# EAGLE design ASPLY (EAGLE 6.1)
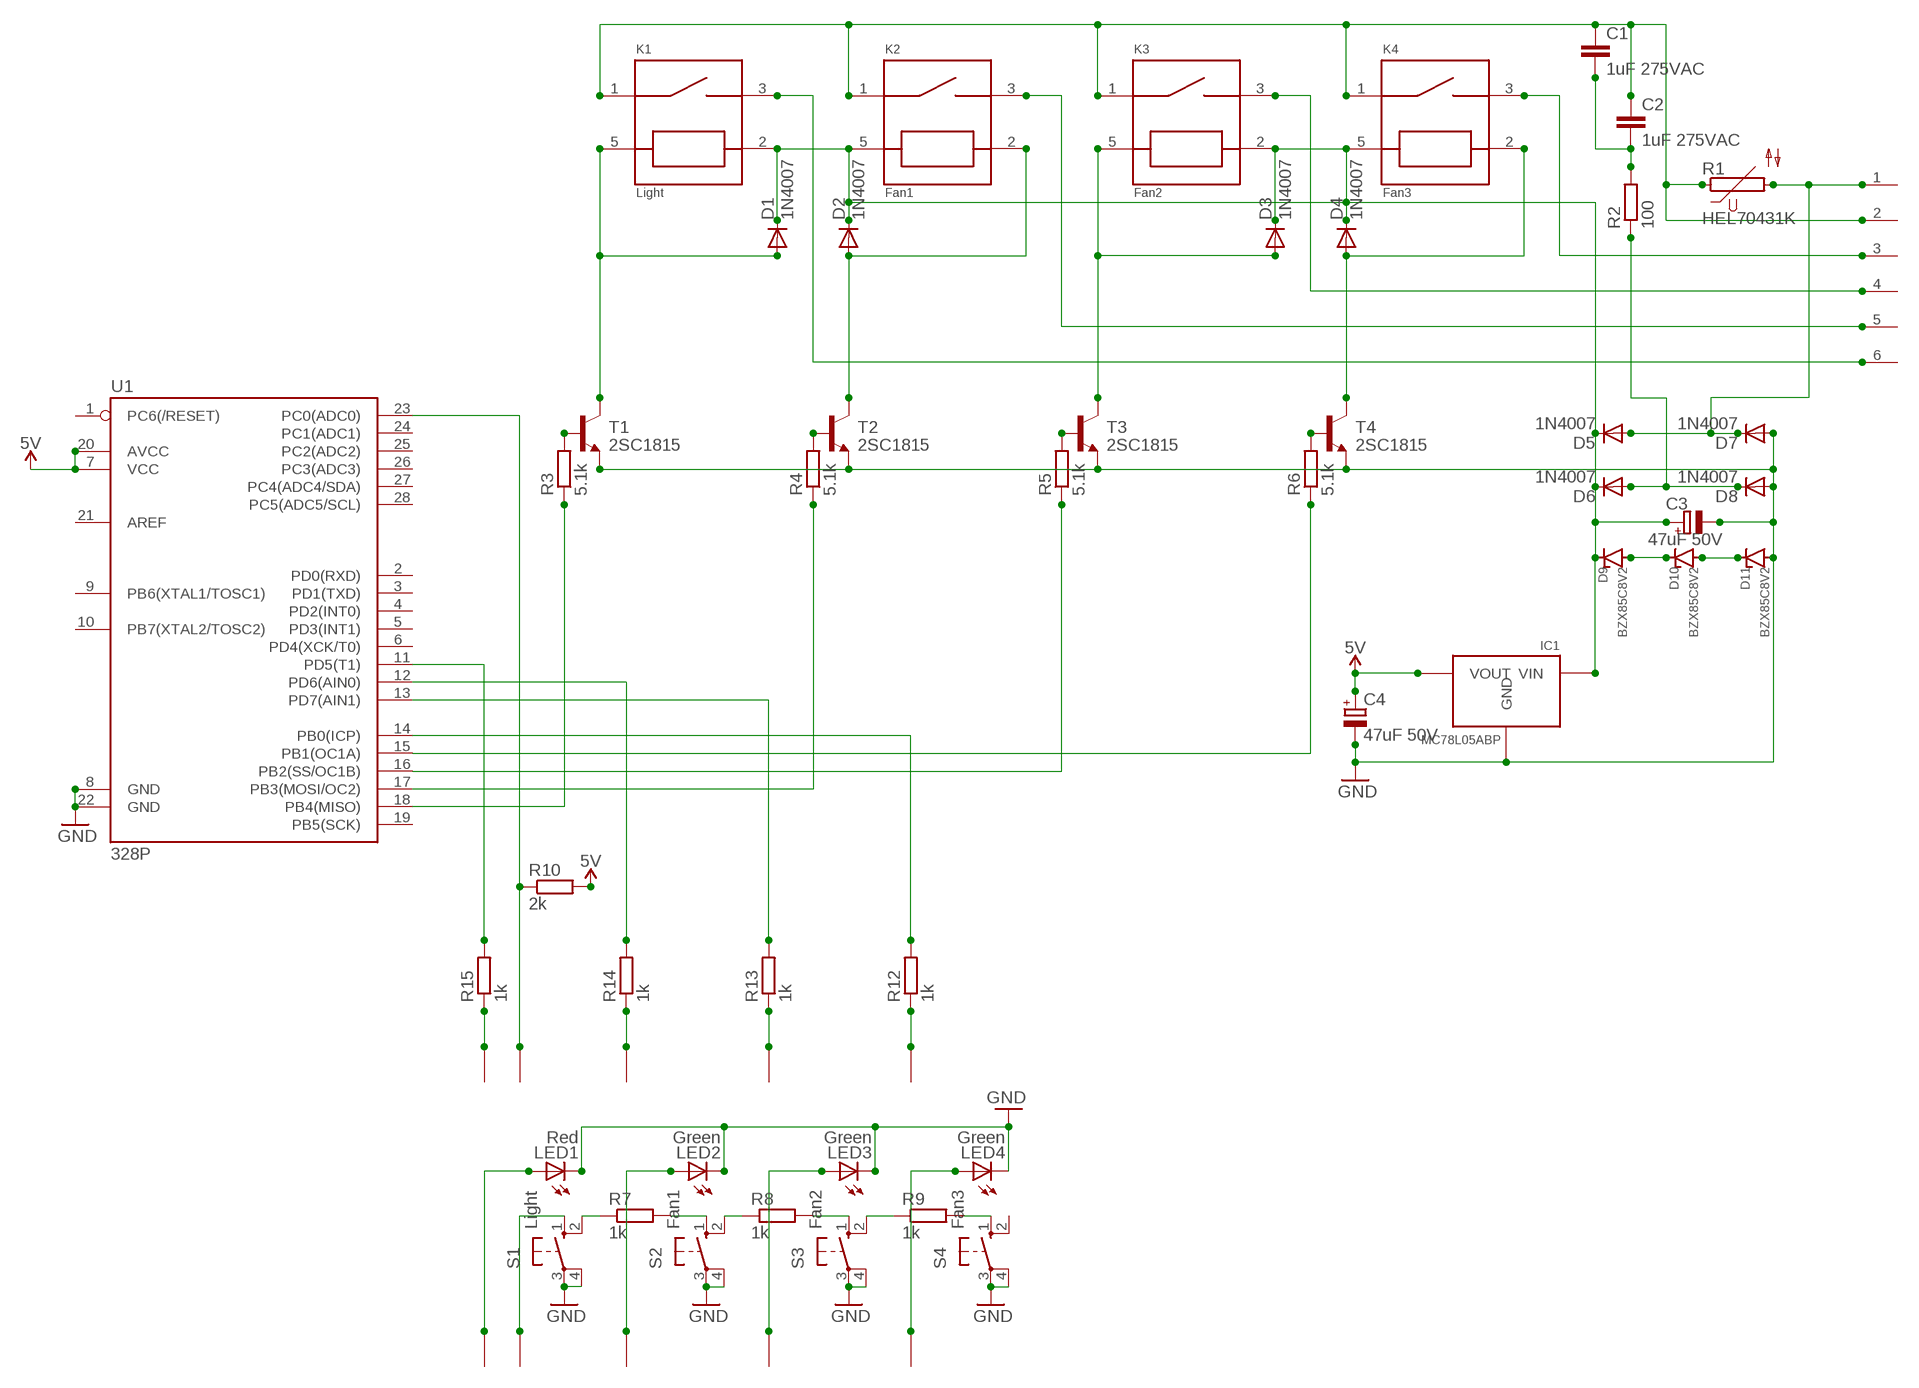
[diagram p0: schematic, sheet 1]

## Parts
C1  1uF 275VAC  C22/8  [C22.5B8]
C2  1uF 275VAC  C22/8  [C22.5B8]
C3  47uF 50V  CPOL-EUE5-6  [E5-6]
C4  47uF 50V  CPOL-EUE5-6  [E5-6]
D1  1N4007  1N4004  [DO41-10]
D2  1N4007  1N4004  [DO41-10]
D3  1N4007  1N4004  [DO41-10]
D4  1N4007  1N4004  [DO41-10]
D5  1N4007  1N4004  [DO41-10]
D6  1N4007  1N4004  [DO41-10]
D7  1N4007  1N4004  [DO41-10]
D8  1N4007  1N4004  [DO41-10]
D9  BZX85C8V2  STAB  [STAB]
D10  BZX85C8V2  STAB  [STAB]
D11  BZX85C8V2  STAB  [STAB]
IC1  MC78L05ABP  [TO-92]
K1  Light  HJR-3FF-S-Z  [RELAY]
K2  Fan1  HJR-3FF-S-Z  [RELAY]
K3  Fan2  HJR-3FF-S-Z  [RELAY]
K4  Fan3  HJR-3FF-S-Z  [RELAY]
LED1  Red  LED3MM  [LED3MM]
LED2  Green  LED3MM  [LED3MM]
LED3  Green  LED3MM  [LED3MM]
LED4  Green  LED3MM  [LED3MM]
P1  MOLEX  [MOLEX]
R1  HEL70431K  S05K11  [S05K11]
R2  100  R-EU_0617/22  [0617/22]
R3  5.1k  R-EU_0204/7  [0204/7]
R4  5.1k  R-EU_0204/7  [0204/7]
R5  5.1k  R-EU_0204/7  [0204/7]
R6  5.1k  R-EU_0204/7  [0204/7]
R7  1k  R-EU_0204/7  [0204/7]
R8  1k  R-EU_0204/7  [0204/7]
R9  1k  R-EU_0204/7  [0204/7]
R10  2k  R-EU_0204/7  [0204/7]
R12  1k  R-EU_0204/7  [0204/7]
R13  1k  R-EU_0204/7  [0204/7]
R14  1k  R-EU_0204/7  [0204/7]
R15  1k  R-EU_0204/7  [0204/7]
S1  Light  10-XX  [B3F-10XX]
S2  Fan1  10-XX  [B3F-10XX]
S3  Fan2  10-XX  [B3F-10XX]
S4  Fan3  10-XX  [B3F-10XX]
T1  2SC1815  [TO92-ECB]
T2  2SC1815  [TO92-ECB]
T3  2SC1815  [TO92-ECB]
T4  2SC1815  [TO92-ECB]
U1  328P  ATMEGA328P_PDIP  [DIP28]
U$1  PIN  [PIN]
U$3  PIN  [PIN]
U$5  PIN  [PIN]
U$7  PIN  [PIN]
U$8  PIN  [PIN]
U$13  PIN  [PIN]
U$14  PIN  [PIN]
U$16  PIN  [PIN]
U$18  PIN  [PIN]
U$20  PIN  [PIN]

## Nets
0: D5.A D7.C P1.1 R1.2
5V: C4.+ IC1.P$1(VOUT) R10.2 U1.7(VCC) U1.20(AVCC)
24V: C3.+ D1.C D2.C D3.C D4.C D5.C D6.C D9.P$1 IC1.P$3(VIN) K1.2 K2.5 K3.2 K4.5
220V: C1.1 C2.1 K1.1 K2.1 K3.1 K4.1 P1.2 R1.1
BUTTONS_INPUT: R10.1 U1.23(PC0(ADC0)) U$8.P$1
GND: C3.- C4.- D7.A D8.A D11.P$2 IC1.P$2(GND) LED1.K(C) LED2.K(C) LED3.K(C) LED4.K(C) S1.3(P) S1.4(P1) S2.3(P) S2.4(P1) S3.3(P) S3.4(P1) S4.3(P) S4.4(P1) T1.E T2.E T3.E T4.E U1.8(GND) U1.22(GND)
LED_FAN1: LED2.A U$18.P$1
LED_FAN1_OUTPUT: R14.2 U1.12(PD6(AIN0))
LED_FAN2: LED3.A U$16.P$1
LED_FAN2_OUTPUT: R13.2 U1.13(PD7(AIN1))
LED_FAN3: LED4.A U$14.P$1
LED_FAN3_OUTPUT: R12.2 U1.14(PB0(ICP))
LED_LIGHT: LED1.A U$20.P$1
LED_LIGHT_OUTPUT: R15.2 U1.11(PD5(T1))
N$1: S1.1(S) U$13.P$1
N$2: K4.3 P1.3
N$3: K3.3 P1.4
N$4: K2.3 P1.5
N$5: K1.3 P1.6
N$6: R7.1 S1.2(S1)
N$7: R6.1 U1.15(PB1(OC1A))
N$8: R5.1 U1.16(PB2(SS/OC1B))
N$9: D1.A K1.5 T1.C
N$10: D2.A K2.2 T2.C
N$11: D3.A K3.5 T3.C
N$12: D4.A K4.2 T4.C
N$13: D6.A D8.C R2.1
N$14: C1.2 C2.2 R2.2
N$15: R7.2 S2.1(S)
N$16: D9.P$2 D10.P$1
N$17: D10.P$2 D11.P$1
N$18: R3.2 T1.B
N$19: R4.2 T2.B
N$20: R5.2 T3.B
N$21: R6.2 T4.B
N$22: R8.1 S2.2(S1)
N$23: R8.2 S3.1(S)
N$24: R9.1 S3.2(S1)
N$25: R9.2 S4.1(S)
N$26: R15.1 U$1.P$1
N$27: R14.1 U$3.P$1
N$28: R13.1 U$5.P$1
N$29: R12.1 U$7.P$1
N$42: R4.1 U1.17(PB3(MOSI/OC2))
N$43: R3.1 U1.18(PB4(MISO))
Unconnected: S4.2(S1) U1.1(PC6(/RESET)) U1.2(PD0(RXD)) U1.3(PD1(TXD)) U1.4(PD2(INT0)) U1.5(PD3(INT1)) U1.6(PD4(XCK/T0)) U1.9(PB6(XTAL1/TOSC1)) U1.10(PB7(XTAL2/TOSC2)) U1.19(PB5(SCK)) U1.21(AREF) U1.24(PC1(ADC1)) U1.25(PC2(ADC2)) U1.26(PC3(ADC3)) U1.27(PC4(ADC4/SDA)) U1.28(PC5(ADC5/SCL))

## Library data of the parts
C1 C2 = capacitor-wima:C: CAPACITOR naming: grid - package width
C3 C4 = rcl:CPOL-EU: POLARIZED CAPACITOR, European symbol
D1-D8 = diode:1N4004: DIODE general purpose rectifier, 1 A
D9-D11 = ASPLY:STAB
IC1 = ASPLY:MC78L05ABP
K1-K4 = ASPLY:HJR-3FF-S-Z
LED1-LED4 = led:LED: LED OSRAM: - CHIPLED LG R971, LG N971, LY N971, LG Q971, LY Q971, LO R971, LY R971 LH N974, LH R974 LS Q976, LO Q976, LY Q976 LO Q996 - Hyper CHIPLED LW Q18S LB Q993, LB Q99A, LB R99A - SideLED LS A670, LO A670, LY A670, LG A670, LP A670 LB A673, LV A673, LT A673, LW A673 LH A674 LY A675 LS A676, LA A676, LO A676, LY A676, LW A676 LS A679, LY A679, LG A679 - Hyper Micro SIDELED® LS Y876, LA Y876, LO Y876, LY Y876 LT Y87S - SmartLED LW L88C, LW L88S LB L89C, LB L89S, LG L890 LS L89K, LO L89K, LY L89K LS L896, LA L896, LO L896, LY L896 - TOPLED LS T670, LO T670, LY T670, LG T670, LP T670 LSG T670, LSP T670, LSY T670, LOP T670, LYG T670 LG T671, LOG T671, LSG T671 LB T673, LV T673, LT T673, LW T673 LH T674 LS T676, LA T676, LO T676, LY T676, LB T676, LH T676, LSB T676, LW T676 LB T67C, LV T67C, LT T67C, LS T67K, LO T67K, LY T67K, LW E67C LS E67B, LA E67B, LO E67B, LY E67B, LB E67C, LV E67C, LT E67C LW T67C LS T679, LY T679, LG T679 LS T770, LO T770, LY T770, LG T770, LP T770 LB T773, LV T773, LT T773, LW T773 LH T774 LS E675, LA E675, LY E675, LS T675 LS T776, LA T776, LO T776, LY T776, LB T776 LHGB T686 LT T68C, LB T68C - Hyper Mini TOPLED® LB M676 - Mini TOPLED Santana® LG M470 LS M47K, LO M47K, LY M47K Source: http://www.osram.convergy.de LUXEON: - LUMILED® LXK2-PW12-R00, LXK2-PW12-S00, LXK2-PW14-U00, LXK2-PW14-V00 LXK2-PM12-R00, LXK2-PM12-S00, LXK2-PM14-U00 LXK2-PE12-Q00, LXK2-PE12-R00, LXK2-PE12-S00, LXK2-PE14-T00, LXK2-PE14-U00 LXK2-PB12-K00, LXK2-PB12-L00, LXK2-PB12-M00, LXK2-PB14-N00, LXK2-PB14-P00, LXK2-PB14-Q00 LXK2-PR12-L00, LXK2-PR12-M00, LXK2-PR14-Q00, LXK2-PR14-R00 LXK2-PD12-Q00, LXK2-PD12-R00, LXK2-PD12-S00 LXK2-PH12-R00, LXK2-PH12-S00 LXK2-PL12-P00, LXK2-PL12-Q00, LXK2-PL12-R00 Source: www.luxeon.com KINGBRIGHT: KA-3528ASYC Source: www.kingbright.com
P1 = ASPLY:MOLEX
R1 = varistor:S05K11: VARISTOR
R2 = resistor:R-EU_: RESISTOR, European symbol
R3-R10 R12-R15 = rcl:R-EU_: RESISTOR, European symbol
S1-S4 = switch-omron:10-XX: OMRON SWITCH; MPN: B3F-1000; OC_FARNELL: 176432; OC_NEWARK: 36M3542
T1-T4 = transistor:2SC1815: NPN EPITAXIAL TRANSISTOR Source: TOSHIBA .. 2SC1815 1.pdf
U1 = SparkFun-IC-Microcontroller:ATMEGA328P_PDIP: Atmel 328P Through hole ATMEGA328P uC used in the Arduino 32kb flash, 1k EEPROM, 2k SRAM Datasheet <http://www.sparkfun.com/datasheets/Components/SMD/ATMega328.pdf> SparkFun Products Storefront component: AVR 28 Pin 20MHz 32K 6A/D - ATMega328P <https://www.sparkfun.com/products/9061> (COM-09061) SparkFun Simon Says - Through-Hole Soldering Kit <https://www.sparkfun.com/products/10547> (KIT-10547) SparkFun Learn to Solder - Simon Says <https://www.sparkfun.com/products/13708> (KIT-13708) SparkFun BigTime Watch Kit <https://www.sparkfun.com/products/11734> (KIT-11734) SparkFun ClockIt <https://www.sparkfun.com/products/10930> (KIT-10930) SparkFun Serial Enabled LCD Kit <https://www.sparkfun.com/products/10097> (LCD-10097) SparkFun Simon Tilts - Through Hole Soldering Kit <https://www.sparkfun.com/products/12634> (KIT-12634) SparkFun Frequency Counter Kit <https://www.sparkfun.com/products/10140> (KIT-10140) FabFM Radio Kit <https://www.sparkfun.com/products/11043> (KIT-11043) SparkFun Binary Blaster Kit <https://www.sparkfun.com/products/12037> (KIT-12037) SparkFun Metro-Gnome <https://www.sparkfun.com/products/9236> (KIT-09236) ATmega328 with Arduino Optiboot (Uno) <https://www.sparkfun.com/products/10524> (DEV-10524); PROD_ID: IC-09136
U$1 U$3 U$5 U$7 U$8 U$13 U$14 U$16 U$18 U$20 = ASPLY:PIN

## Board
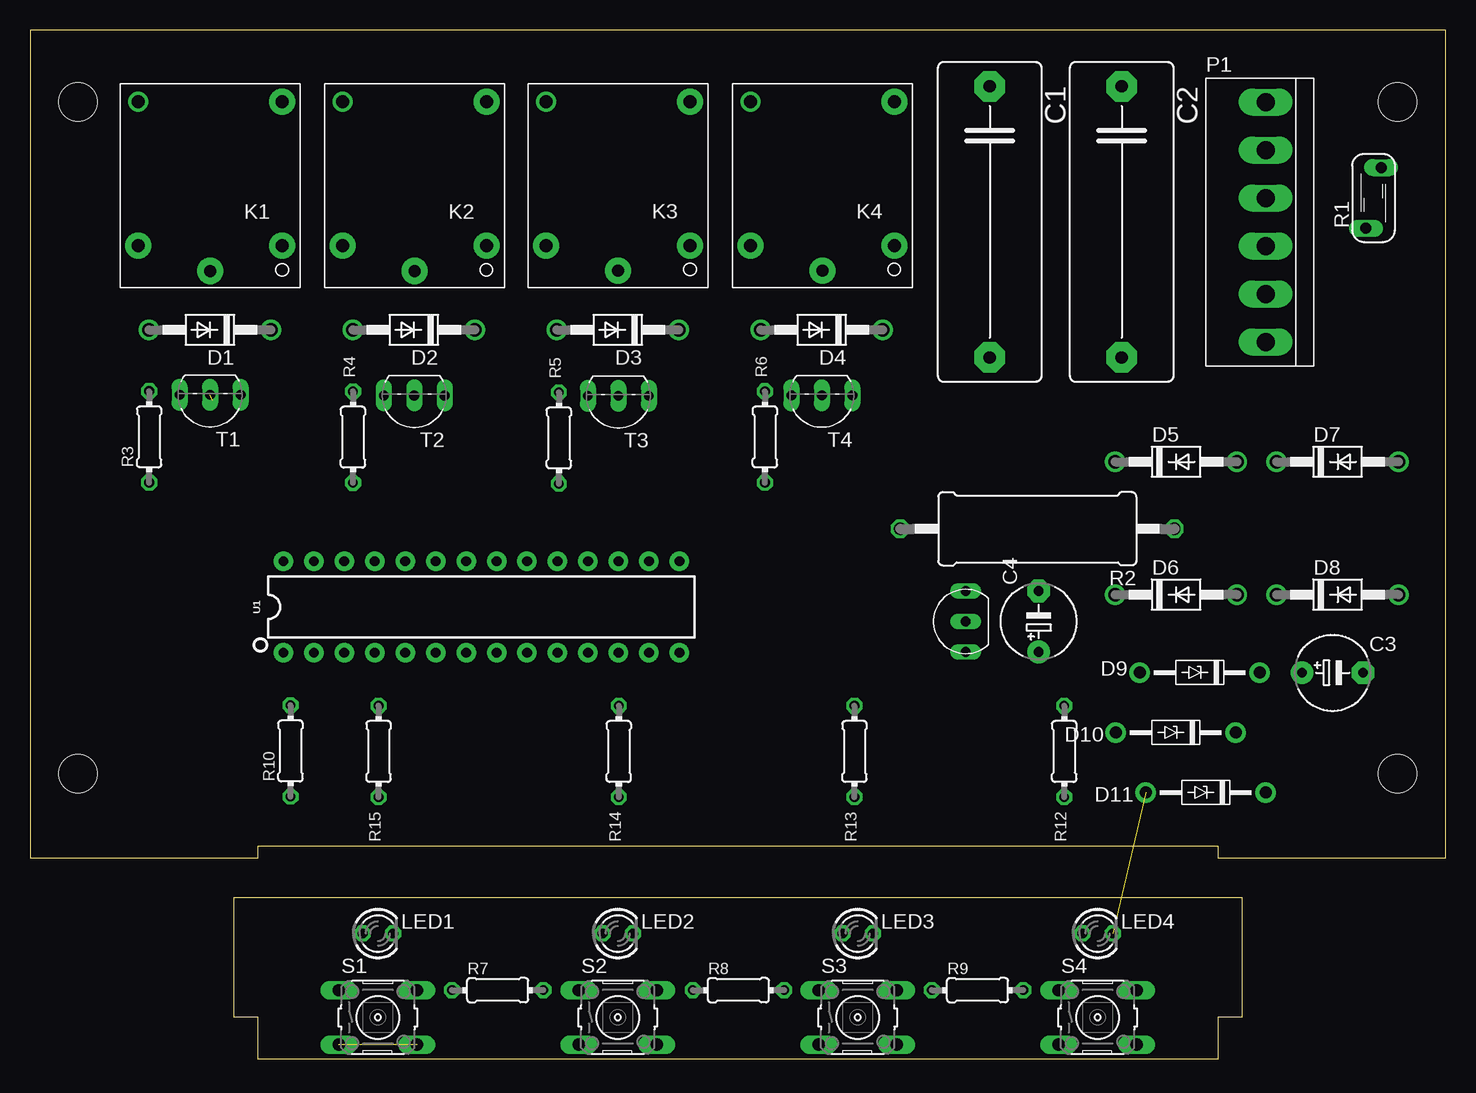
[diagram p1: board, top side]
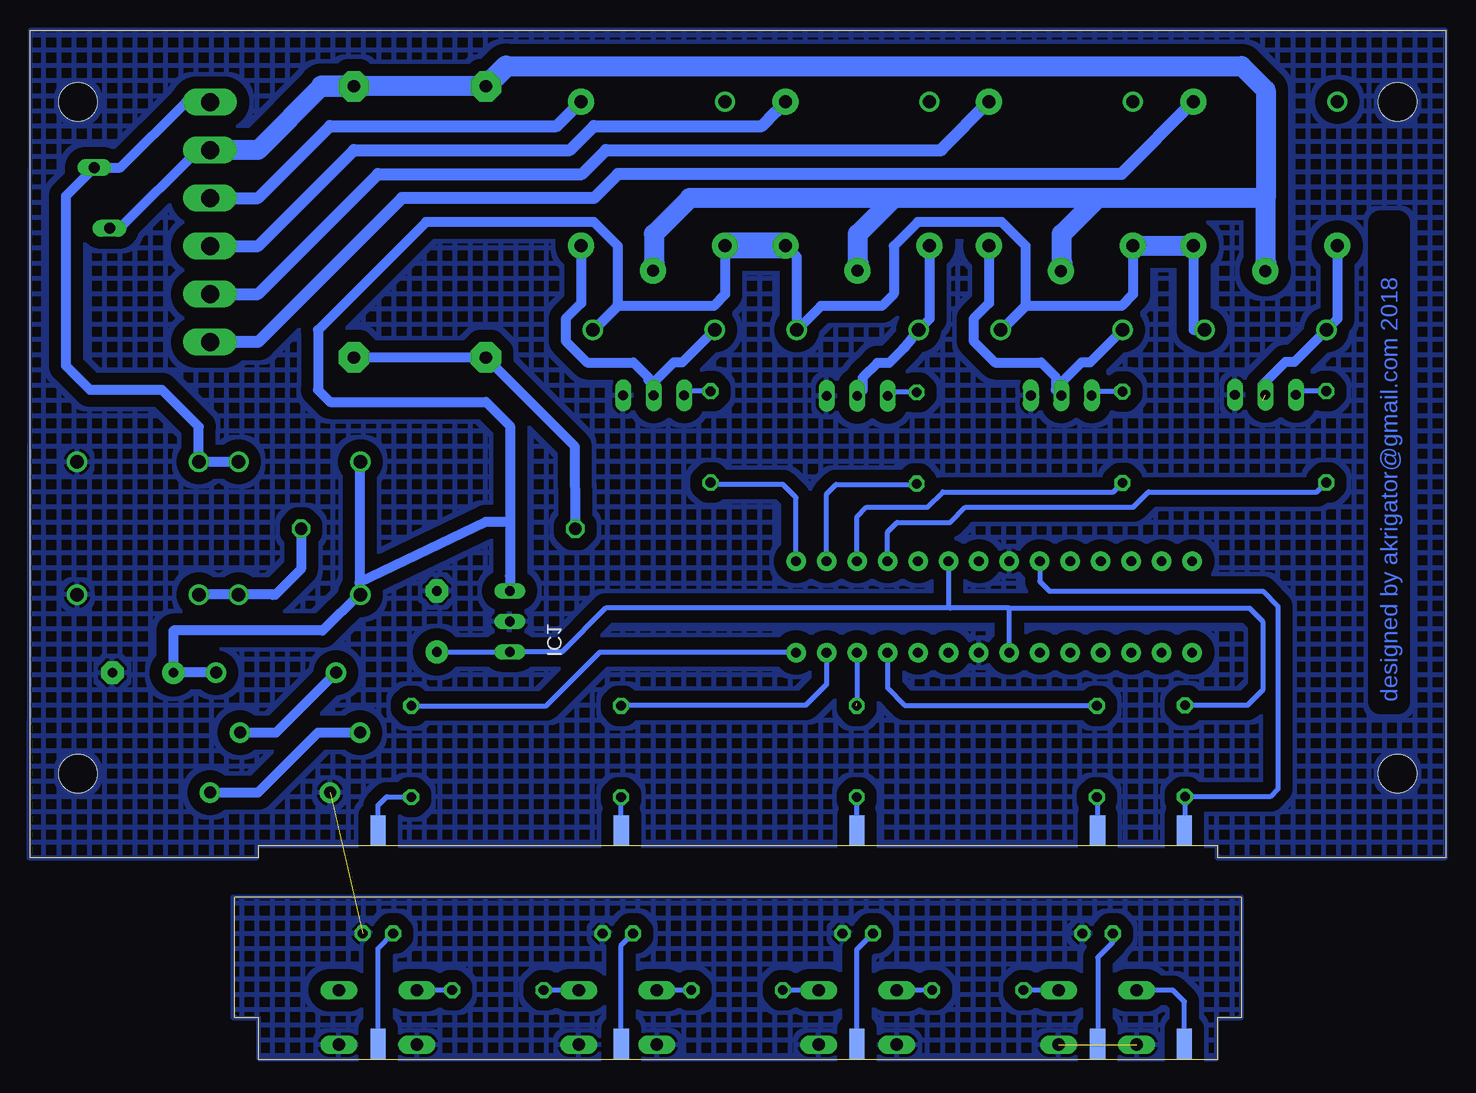
[diagram p2: board, bottom side, seen from below]

Size 118 x 85.83 mm. Coordinates in mm from the lower left corner, seen from the top.
Outline: 0,16.82 19,16.82 19,17.82 99,17.82 99,16.82 118,16.82 118,85.83 0,85.83 0,16.82
Outline: 17,13.5 101,13.5 101,3.5 99,3.5 99,0 19,0 19,3.5 17,3.5 17,13.5
Copper layers 16: Bottom 0.035mm
Design rules: minimum track width 10mil, minimum drill 24mil, track to track 40mil, track to pad 40mil, pad to pad 40mil, via to via 40mil, smd to smd 40mil, copper to edge 0mil, drill to drill 0mil, minimum pad ring 10mil, minimum via ring 8mil, stop-mask expansion 0mil, vias tented up to drill 0mil, thermal gap 10mil
Holes 3.2 mm at 4,23.82 114,23.82 4,79.83 114,79.83

### Footprints (pad centres in the part's own frame; a part is rotated, then mirrored left to right if it is on the bottom)
C22.5B8 = drill 1.016 pad 2.54 octagon: 1 -11.303,0; 2 11.303,0
E5-6 = drill 0.813 pad 1.905: + -2.54,0 | drill 0.813 pad 1.905 octagon: - 2.54,0
DO41-10 = drill 1.118: A 5.08,0; C -5.08,0
STAB = drill 1 pad 1.676: P$1 -5,0; P$2 5,0
TO-92 = drill 0.8 long: P$1 0,2.54; P$2 0,0; P$3 0,-2.54
RELAY = drill 1 pad 2.184: 1 0,7.1 | drill 1.1 pad 2.184: 2 -6,5; 3 -6,-7; 5 6,5 | drill 1.1 pad 1.27: 4 6,-7
LED3MM = drill 0.813 octagon: A -1.27,0; K 1.27,0
MOLEX = drill 1.5 long: 1 0,10; 2 0,6; 3 0,2; 4 0,-2; 5 0,-6; 6 0,-10
S05K11 = drill 0.914 long: 1 -0.635,-2.54; 2 0.635,2.54
0617/22 = drill 1.016 octagon: 1 -11.43,0; 2 11.43,0
0204/7 = drill 0.813 octagon: 1 -3.81,0; 2 3.81,0
B3F-10XX = drill 1.016 long: 1 -3.251,2.261; 2 3.251,2.261; 3 -3.251,-2.261; 4 3.251,-2.261
TO92-ECB = drill 0.813 long: B 2.54,0; C 0,0; E -2.54,0
DIP28 = drill 0.813 pad 1.626: 1 -16.51,-3.81; 2 -13.97,-3.81; 3 -11.43,-3.81; 4 -8.89,-3.81; 5 -6.35,-3.81; 6 -3.81,-3.81; 7 -1.27,-3.81; 8 1.27,-3.81; 9 3.81,-3.81; 10 6.35,-3.81; 11 8.89,-3.81; 12 11.43,-3.81; 13 13.97,-3.81; 14 16.51,-3.81; 15 16.51,3.81; 16 13.97,3.81; 17 11.43,3.81; 18 8.89,3.81; 19 6.35,3.81; 20 3.81,3.81; 21 1.27,3.81; 22 -1.27,3.81; 23 -3.81,3.81; 24 -6.35,3.81; 25 -8.89,3.81; 26 -11.43,3.81; 27 -13.97,3.81; 28 -16.51,3.81
PIN = smd 1.27 x 2.54 bottom: P$1 0,1.27

### Placement (x,y rotation side)
C1  80,69.83 270 top
C2  91,69.83 270 top
C3  108.59,32.24 0 top
C4  84.09,36.52 90 top
D1  15,60.83 180 top
D2  32,60.83 180 top
D3  49,60.83 180 top
D4  66,60.83 180 top
D5  95.54,49.83 0 top
D6  95.54,38.74 0 top
D7  109,49.83 0 top
D8  109,38.74 0 top
D9  97.5,32.25 180 top
D10  95.5,27.25 180 top
D11  98,22.25 180 top
IC1  78.01,36.52 180 top
K1  15.02,72.83 180 top
K2  32.06,72.83 180 top
K3  49.02,72.86 180 top
K4  66.06,72.86 180 top
LED1  29,10.5 0 top
LED2  49,10.5 0 top
LED3  69,10.5 0 top
LED4  89,10.5 0 top
P1  103,69.83 0 top
R1  112,71.83 0 top
R2  83.97,44.24 180 top
R3  9.94,51.91 90 top
R4  26.92,51.88 90 top
R5  44.09,51.81 90 top
R6  61.27,51.9 90 top
R7  38.99,5.78 0 top
R8  59.05,5.78 0 top
R9  78.99,5.78 0 top
R10  21.72,25.71 90 top
R12  86.22,25.67 90 top
R13  68.73,25.67 90 top
R14  49.08,25.67 90 top
R15  29.06,25.67 90 top
S1  29,3.5 0 top
S2  49,3.5 0 top
S3  69,3.5 0 top
S4  89,3.5 0 top
T1  15.01,55.4 180 top
T2  32.03,55.36 180 top
T3  49.05,55.32 180 top
T4  66.01,55.36 180 top
U1  37.63,37.73 0 top
U$1  29,17.82 0 top
U$3  49.06,17.82 0 top
U$5  68.71,17.82 0 top
U$7  88.99,17.82 0 top
U$8  21.77,17.82 0 top
U$13  21.77,0 0 top
U$14  88.99,0 0 top
U$16  68.71,0 0 top
U$18  49.06,0 0 top
U$20  29,0 0 top

### Tracks (layer width: path | path; a pad name or v marks a point on that pad's centre or on a via)
0
  Bottom 0.813: D5.A D7.C 103.92,52.74 107,55.83 113,55.83 115,57.83 115,72 R1.2 110.46,74.36 105,79.83 P1.1
5V
  Bottom 0.406: C4.+ IC1.P$1 73.66,33.97 70.01,37.62 41.27,37.62 | U1.7 36.36,37.62 | 36.36,37.62 41.27,37.62 | U1.20 41.44,37.78 41.27,37.62 | 36.36,37.62 16.35,37.62 15.24,36.51 15.24,30.8 16.51,29.52 R10.2
24V
  Bottom 0.813: K1.2 21.02,60.84 21,60.83 D1.C | K2.5 26.06,63.77 27,62.83 35,62.83 | 35,62.83 35.08,62.83 D2.C 37,60.83 35,62.83 | 35,62.83 35,67.83 37,69.83 44,69.83 46,67.83 46,63.83 47,62.83 52.08,62.83 D3.C 54.08,66.91 K3.2 | K4.5 60.06,63.77 61,62.83 69,62.83 | 69,62.83 69.08,62.83 D4.C 71,60.83 69,62.83 | 69,62.83 69,67.83 71,69.83 85,69.83 94,60.83 94,55.83 93,54.83 80,54.83 78,52.83 78,44.79 | 78,44.79 80,44.83 90.54,39.74 | 90.54,39.74 90.54,38.83 | 90.54,38.83 D6.C | 90.54,38.83 93.62,35.75 106.05,35.75 C3.+ | D5.C 90.54,49.74 90.54,39.74 | 78,44.79 78,40.34 IC1.P$3 | D9.P$1 C3.+ | C3.+
  Bottom 1.676: K2.5 K1.2
  Bottom 2.184: K3.2 K4.5
220V
  Bottom 0.254: K1.1 15.24,66.35 15,66.35 | 79.14,81.99 78.74,81.59 C1.1 | K2.1 31.75,66.35 32,66.35 | K3.1 49.53,66.35 49,66.35 | K4.1 66.04,66.35 66,66.35 | C2.1 91.44,81.59 91.44,81.12
  Bottom 0.813: R1.1 110.54,69.28 104,75.83 P1.2
  Bottom 1.676: 78.3,82.83 17,82.83 15,80.83 15,71.83 | 15,66.35 15,71.83 | 15,71.83 29,71.83 | 32,66.35 32,68.83 29,71.83 | 29,71.83 46,71.83 | 49,66.35 49,68.83 46,71.83 | 46,71.83 63,71.83 66,68.83 66,66.35 | C1.1 91.44,81.12 | 93.7,81.12 99,75.83 P1.2
  Bottom 1.778: 15,65.83 15,66.35 | 32,65.83 32,66.35 | 49,65.83 49,66.35 | 66,66.35 66,65.83 | 78.3,82.83 79.14,81.99 C1.1 | 91.44,81.12 93.7,81.12
BUTTONS_INPUT
  Bottom 0.406: U1.23 33.82,39.85 33.02,39.05 15.24,39.05 13.97,37.78 13.97,22.54 14.61,21.91 R10.1 21.72,19.15 U$8.P$1
GND  (2 unrouted)
  pour Bottom (hatched): 0,85.79 117.98,85.79 118.11,16.82 99.06,16.82 99.06,17.84 19.05,17.84 19.05,16.82 0,16.82
  pour Bottom (hatched): 17.02,13.52 101.09,13.52 101.09,3.49 98.93,3.49 98.93,0.06 19.05,0.06 19.05,3.49 17.02,3.49
LED_FAN1
  Bottom 0.406: U$18.P$1 49.06,9.16 LED2.A
LED_FAN1_OUTPUT  (1 unrouted)
  Bottom 0.406: U1.12 49.06,29.69 48.9,29.52
LED_FAN2
  Bottom 0.406: U$16.P$1 68.71,9.52 LED3.A
LED_FAN2_OUTPUT
  Bottom 0.406: U1.13 51.6,31.27 53.34,29.52 68.69,29.52 R13.2
LED_FAN3
  Bottom 0.406: U$14.P$1 88.99,9.24 LED4.A
LED_FAN3_OUTPUT
  Bottom 0.406: R12.2 74.97,29.48 70.48,33.97 54.19,33.97 U1.14
LED_LIGHT
  Bottom 0.406: U$20.P$1 29,8.5 27.73,9.77 LED1.A
LED_LIGHT_OUTPUT
  Bottom 0.406: U1.11 46.52,30.96 45.09,29.52 29.1,29.52 R15.2
N$1
  Bottom 0.406: U$13.P$1 21.77,4.81 22.73,5.78 25.73,5.78 S1.1
N$2
  Bottom 1.016: P1.3 99,71.83 93,77.83 74.09,77.83 K4.3
N$3
  Bottom 0.254: K3.3 55.88,79.06 55.83,79
  Bottom 1.016: P1.4 99,67.83 91,75.83 73,75.83 71,77.83 57,77.83 55.83,79 55,79.83
N$4
  Bottom 1.016: P1.5 99,63.83 89,73.83 72,73.83 70,75.83 42,75.83 42,75.89 K2.3
N$5
  Bottom 1.016: P1.6 99,59.83 87,71.83 71,71.83 69,73.83 27,73.83 27,73.86 K1.3
N$6
  Bottom 0.406: S1.2 35.16,5.76 R7.1
N$7
  Bottom 0.406: U1.15 54.14,46.83 55.24,47.94 61.12,47.94 R6.1
N$8
  Bottom 0.406: U1.16 51.6,47.14 50.8,47.94 44.15,47.94 R5.1
N$9  (1 unrouted)
  Bottom 0.813: K1.5 9.02,61.73 D1.A 12.6,58.15 13.34,58.15 15.24,56.24 15.24,54.92
N$10
  Bottom 0.813: K2.2 38.06,63.04 39.34,61.76 39.34,59.89 37.55,58.1 33.71,58.1 32.49,56.88 32.49,55.81 T2.C 32.03,56.42 30.35,58.1 29.65,58.1 D2.A
N$11
  Bottom 0.813: 43,67.84 K3.5 43.02,61.73 D3.A 45.19,59.27 46.4,58.06 47.37,58.06 48.59,56.84 48.59,55.77 T3.C
N$12
  Bottom 0.813: D4.A 63.64,58.11 64.34,58.11 66.01,56.43 66.01,56.2 | 66.01,56.2 T4.C | K4.2 72.06,63.04 73.34,61.76 73.34,59.89 71.56,58.11 67.69,58.11 66.47,56.89 66.47,56.65 66.01,56.2
N$13
  Bottom 0.254: D6.A 97.79,38.41 97.79,38.74
  Bottom 0.813: D8.C D6.A 97.79,38.74 97.54,38.74 95.4,40.88 R2.1
N$14
  Bottom 0.813: R2.2 72.57,51.09 C1.2 C2.2
N$15
  Bottom 0.406: R7.2 45.73,5.78 S2.1
N$16
  Bottom 0.813: D10.P$1 97.5,27.25 D9.P$2
N$17
  Bottom 0.813: D11.P$1 99,22.25 94,27.25 D10.P$2
N$18
  Bottom 0.406: R3.2 12.16,55.72 T1.B
N$19
  Bottom 0.406: R4.2 29.16,55.69 T2.B
N$20
  Bottom 0.406: R5.2 46.21,55.62 T3.B
N$21
  Bottom 0.406: R6.2 63.13,55.71 T4.B
N$22
  Bottom 0.406: S2.2 55.23,5.76 R8.1
N$23
  Bottom 0.406: R8.2 65.73,5.78 S3.1
N$24
  Bottom 0.406: S3.2 75.17,5.76 R9.1
N$25
  Bottom 0.406: R9.2 85.73,5.78 S4.1
N$26
  Bottom 0.406: U$1.P$1 29,21.81 R15.1
N$27
  Bottom 0.406: U$3.P$1 49.06,21.84 R14.1
N$28
  Bottom 0.406: U$5.P$1 68.71,21.84 R13.1
N$29
  Bottom 0.406: U$7.P$1 88.99,21.18 88.27,21.91 86.26,21.91 R12.1
N$42
  Bottom 0.406: U1.17 49.06,45.24 48.26,46.03 43.18,46.03 41.91,47.3 27.69,47.3 R4.1
N$43
  Bottom 0.406: U1.18 46.52,43.97 45.72,44.77 41.27,44.77 40.01,46.03 26.04,46.03 24.77,47.3 10.73,47.3 R3.1

### Text on the board
Bottom: designed by akrigator@gmail.com 2018